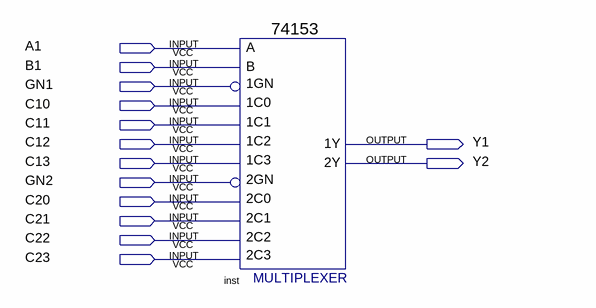
[diagram p0: schematic sheet]
// Quartus schematic test_74153.bdf as structural Verilog: 1 symbols, 14 pins
module test_74153 (
  input  A1,
  input  B1,
  input  GN1,
  input  C10,
  input  C11,
  input  C12,
  input  C13,
  input  GN2,
  input  C20,
  input  C21,
  input  C22,
  input  C23,
  output Y1,
  output Y2
);

  \74153  inst (
    .\1C1 (C11), .\1GN (GN1), .\1C0 (C10), .\2C0 (C20), .\2GN (GN2), .\2C2 (C22), .\1C2 (C12), .\1C3 (C13),
    .B(B1), .A(A1), .\2C1 (C21), .\2C3 (C23), .\1Y (Y1), .\2Y (Y2));
endmodule
